# Altium schematic sheet PSSchematic.SchDoc
size A4
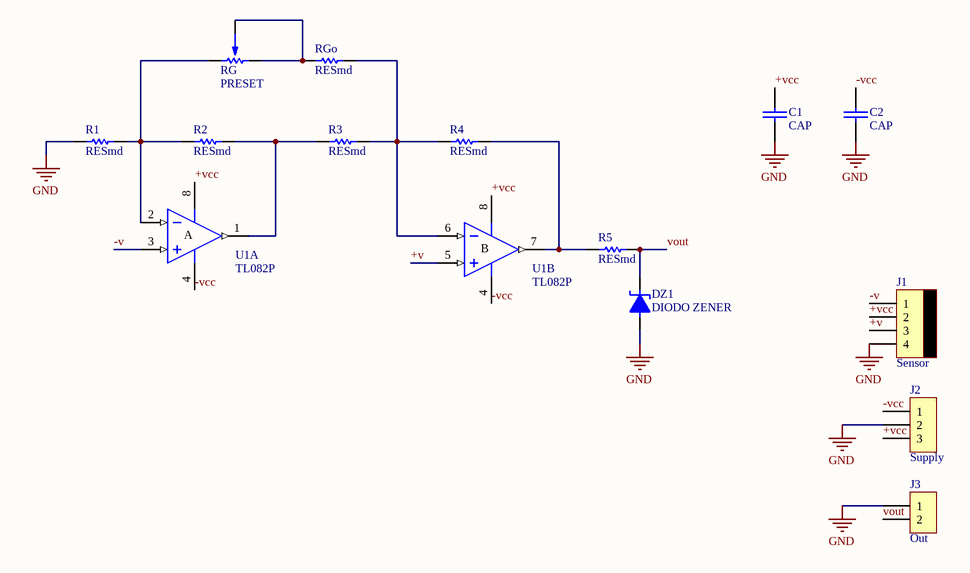
[diagram p0: PSSchematic.SchDoc]

## Parts
C1  CAP  [CAP100]
C2  CAP  [CAP100]
DZ1  DIODO ZENER  [DO41]
J1  Sensor  [MOLEX4]
J2  Supply  [BORNERA3]
J3  Out  [BORNERA2]
R1  RESmd  [0805]
R2  RESmd  [0805]
R3  RESmd  [0805]
R4  RESmd  [0805]
R5  RESmd  [0805]
RG  PRESET  [PRESET V]
RGo  RESmd  [0805]
U1  TL082P  [P008]  (parts A,B of 2)

## Nets
GND: C1.2 C2.2 DZ1.1 J1.4 J2.2 J3.1 R1.1
+v: J1.3 U1.5(IN+)
+vcc: C1.1 J1.2 J2.3 U1.8(V+)
-v: J1.1 U1.3(IN+)
-vcc: C2.1 J2.1 U1.4(V-)
vout: DZ1.2 J3.2 R5.2
NetR1_2: R1.2 R2.1 RG.1 U1.2(IN-)
NetR2_2: R2.2 R3.1 U1.1(OUT)
NetR3_2: R3.2 R4.1 RGo.2 U1.6(IN-)
NetR4_2: R4.2 R5.1 U1.7(OUT)
NetRG_2: RG.2 RG.3 RGo.1

## Notes on the sheet
- (in symbol TL082P, part A) A
- (in symbol TL082P, part B) B

## Library data of the parts
J1 = MOLEX4
J2 = BORNERA 3
J3 = BORNERA 2
R1-R5 RGo = RES
U1 = TL082P: JFET-Input Operational Amplifier; Published: 16-Jan-2001; LatestRevisionDate: 04-Mar-2005; LatestRevisionNote: Stylized 3D Model Added.; DatasheetVersion: Feb-1999; PackageVersion: Jun-1999; PackageReference: P008; Publisher: Altium Limited; PackageDescription: DIP; 8 Leads; Row Spacing 7.62 mm; Pitch 2.54 mm; Code_JEDEC: MO-001-AN; ComponentLink1Description: Manufacturer Link; ComponentLink1URL: http://www.ti.com/; ComponentLink2Description: Datasheet; ComponentLink2URL: http://www-s.ti.com/sc/ds/tl082.pdf